# Altium schematic sheet Easyeda xl6007.schdoc
size 262 x 134 mm
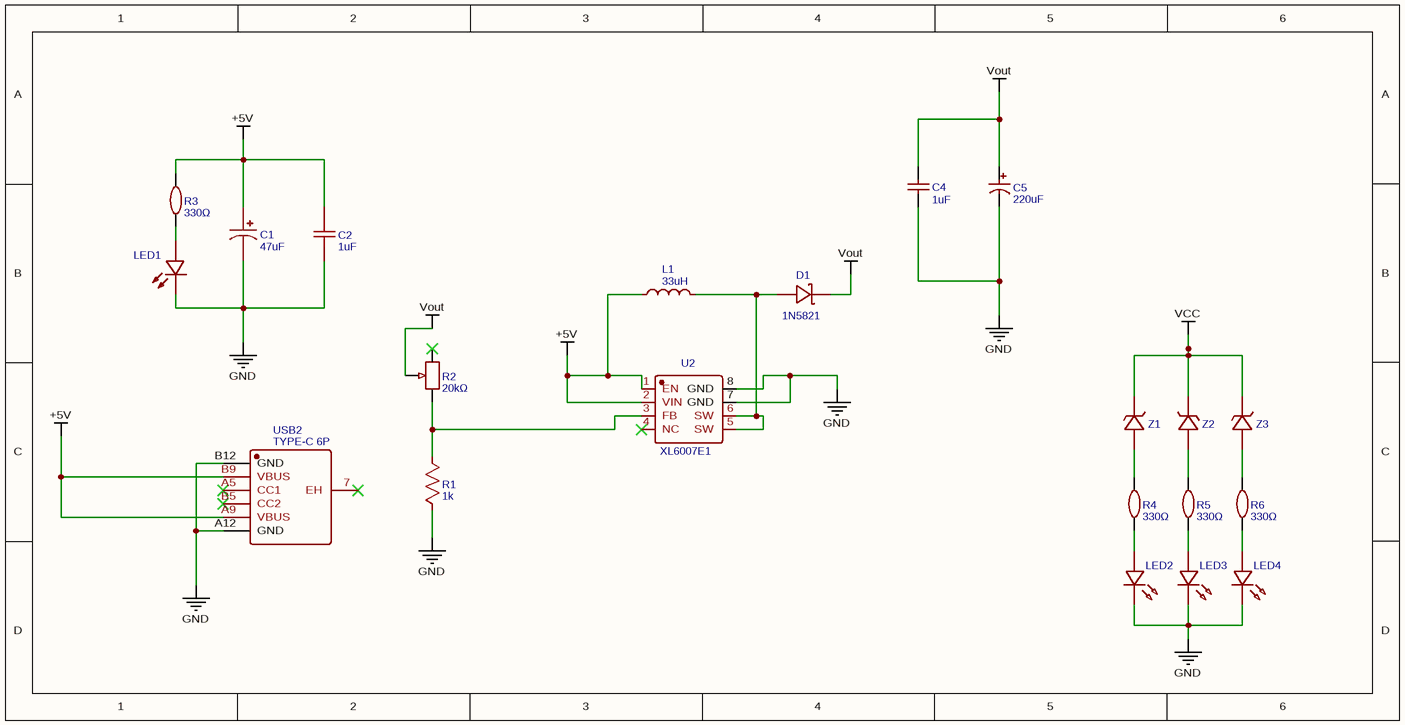
[diagram p0: Easyeda xl6007.schdoc]

## Parts
C1  47uF  [CAP-TH_BD6.3-P2.5-D0.5]
C2  1uF  [C0402]
C4  1uF  [C0805]
C5  220uF  [CAP-TH_BD8.0-P3.50-D0.6-FD]
D1  1N5821  [DO-201AD_BD5.3-L8.4-P12.50-D1.4-RD]
L1  33uH  [IND-SMD_L11.5-W10.5_MJC-1040T]
LED1  KT-0603R  [LED0603-RD]  (value not drawn)
LED2  LED-0603_G  [LED0603_GREEN]  (value not drawn)
LED3  R2  [LED0603_RED]  (value not drawn)
LED4  LED-0603_B  [LED0603_BLUE]  (value not drawn)
R1  1k  [R_AXIAL-0.3]
R2  20kΩ  [RES-ADJ-TH_3P-L7.1-W6.9-P2.50-L_3362P]
R3  330Ω  [R0603]
R4  330Ω  [R0603]
R5  330Ω  [R0603]
R6  330Ω  [R0603]
U2  XL6007E1  [SOIC-8_L4.9-W3.8-P1.27-LS6.0-BL]
USB2  TYPE-C 6P  [TYPE-C-SMD_TYPE-C-6P]
Z1  Z1  [SOD-523_L1.2-W0.8-LS1.6-RD]  (value not drawn)
Z2  Z2  [SOD-523_L1.2-W0.8-LS1.6-FD]  (value not drawn)
Z3  Z3  [SOD-523_L1.2-W0.8-LS1.6-RD]  (value not drawn)

## Nets
+5V: C1.1 C2.1 L1.1 R3.2 U2.1(EN) U2.2(VIN) USB2.A9(VBUS) USB2.B9(VBUS)
GND: C1.2 C2.2 C4.1 C5.2 LED1.1(K) LED2.2 LED3.2 LED4.2 R1.1 U2.7(GND) U2.8(GND) USB2.A12(GND) USB2.B12(GND)
VCC: Z1.1(K) Z2.2(K) Z3.1(K)
Vout: C4.2 C5.1 D1.1(C) R2.2
NetD1_2: D1.2(A) L1.2 U2.5(SW) U2.6(SW)
NetLED1_2: LED1.2(A) R3.1
NetLED2_1: LED2.1 R4.1
NetLED3_1: LED3.1 R5.1
NetLED4_1: LED4.1 R6.1
NetR1_2: R1.2 R2.1 U2.3(FB)
NetR4_2: R4.2 Z1.2(A)
NetR5_2: R5.2 Z2.1(A)
NetR6_2: R6.2 Z3.2(A)

Not connected (* = marked no-connect by the designer): R2 3*; U2 4(NC)*; USB2 7(EH)* A5(CC1)* B5(CC2)*

## Library data of the parts
C1 = 47uF: Manufacturer: HRK(鸿瑞凯电子); Manufacturer Part: 50V47uF CD288; Contributor: lcsc; nameAlias: Value; Supplier: LCSC; Supplier Part: C2960223; JLCPCB Part Class: Extended Part; spicePre: U; spiceSymbolName: 50V47UF CD288
C2 = 1uF: Manufacturer: Walsin(华新科); Manufacturer Part: 0402X105K100CT; nameAlias: Value; Contributor: LCSC; Supplier: LCSC; Supplier Part: C164868; JLCPCB Part Class: Extended Part; spicePre: C; spiceSymbolName: 0402X105K100
C4 = 1uF: Manufacturer Part: CL21B105KBFNNNE; Manufacturer: SAMSUNG(三星); nameAlias: Value; Supplier: LCSC; Supplier Part: C28323; JLCPCB Part Class: Basic Part; spicePre: C; spiceSymbolName: CL21B105KBFNNNE
C5 = 220uF: Manufacturer: AISHI(艾华集团); Manufacturer Part: ERE1VM221F12OT; nameAlias: Value; Supplier: LCSC; Supplier Part: C106510; JLCPCB Part Class: Extended Part; spicePre: C; spiceSymbolName: ERE1VM221F12OT
D1 = 1N5821: Manufacturer: onsemi(安森美); Manufacturer Part: 1N5821RLG; Supplier: LCSC; Supplier Part: C9119; JLCPCB Part Class: Extended Part; spicePre: D; spiceSymbolName: 1N5821RLG
L1 = 33uH: Manufacturer: FC(方成); Manufacturer Part: FCH1040-330M; nameAlias: Value; Contributor: lcsc; Supplier: LCSC; Supplier Part: C20415547; JLCPCB Part Class: Extended Part; spicePre: L; spiceSymbolName: FCH1040-330M
LED1 = KT-0603R: Manufacturer: KENTO; Supplier: LCSC; Manufacturer Part: KT-0603R; Supplier Part: C2286; JLCPCB Part Class: Basic Part; spicePre: L; spiceSymbolName: KT-0603R
LED2 = LED-0603_G: Manufacturer: EVERLIGHT(台湾亿光); Manufacturer Part: 19-217/GHC-YR1S2/3T; Contributor: LCEDA_Lib; Supplier Part: C72043; Supplier: LCSC; spicePre: L; spiceSymbolName: LED-0603_G
LED3 = R2: Manufacturer: EVERLIGHT(台湾亿光); Manufacturer Part: 19-217/R6C-AL1M2VY/3T; Contributor: LCEDA_01; Supplier Part: C72044; Supplier: LCSC; spicePre: L; spiceSymbolName: LED-0603_R
LED4 = LED-0603_B: Manufacturer: EVERLIGHT(台湾亿光); Manufacturer Part: 19-217/BHC-ZL1M2RY/3T; Contributor: LCEDA_01; Supplier Part: C72041; Supplier: LCSC; spicePre: L; spiceSymbolName: LED-0603_B
R1 = 1k: nameAlias: Value(Ω); Contributor: LCEDA_Lib; spicePre: R; spiceSymbolName: R_AXIAL-0.3_US
R2 = 20kΩ: Manufacturer: BOCHEN(博晨); Manufacturer Part: 3362P-1-203; Resistance(Ohms): 20K; nameAlias: Value; Contributor: LCSC; Supplier: LCSC; Supplier Part: C118933; JLCPCB Part Class: Extended Part; spicePre: R; spiceSymbolName: 3362P-1-203_C118933
R3-R6 = 330Ω: Manufacturer: UNI-ROYAL(厚声); Manufacturer Part: 0603WAF3300T5E; nameAlias: Value; Supplier: LCSC; Supplier Part: C23138; JLCPCB Part Class: Basic Part; spicePre: R; spiceSymbolName: 0603WAF3300T5E
U2 = XL6007E1: Manufacturer: XLSEMI(芯龙); Contributor: lcsc; Supplier: LCSC; Supplier Part: C5240411; Manufacturer Part: XL6007E1; JLCPCB Part Class: Extended Part; spicePre: U; spiceSymbolName: XL6007E1_C5240411
USB2 = TYPE-C 6P: Manufacturer: SHOU HAN(首韩); Contributor: LCSC; Supplier: LCSC; Supplier Part: C456012; Manufacturer Part: TYPE-C 6P; JLCPCB Part Class: Extended Part; spicePre: U; spiceSymbolName: TYPE-C 6P
Z1 = Z1: Manufacturer: CJ(江苏长电/长晶); Manufacturer Part: BZX584C8V2; Contributor: lcsc; Supplier: LCSC; Supplier Part: C2991969; JLCPCB Part Class: Extended Part; spicePre: U; spiceSymbolName: BZX584C8V2
Z2 = Z2: Manufacturer: 宏迦橙; Manufacturer Part: BZX584C15; Contributor: lcsc; Supplier: LCSC; Supplier Part: C19077466; JLCPCB Part Class: Extended Part; spicePre: D; spiceSymbolName: BZX584C15
Z3 = Z3: Manufacturer: null; Manufacturer Part: BZX584C20-TP; Contributor: LCSC; Supplier: LCSC; Supplier Part: C725518; JLCPCB Part Class: Extended Part; spicePre: D; spiceSymbolName: BZX584C20-TP